# EAGLE design lcd_5_breakout (EAGLE 5.11)
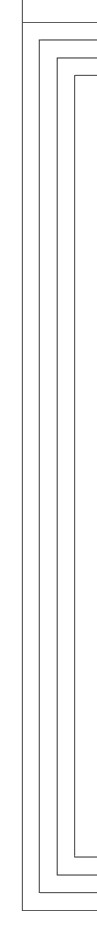
[diagram p0: schematic, sheet 1, part 1 of 2]
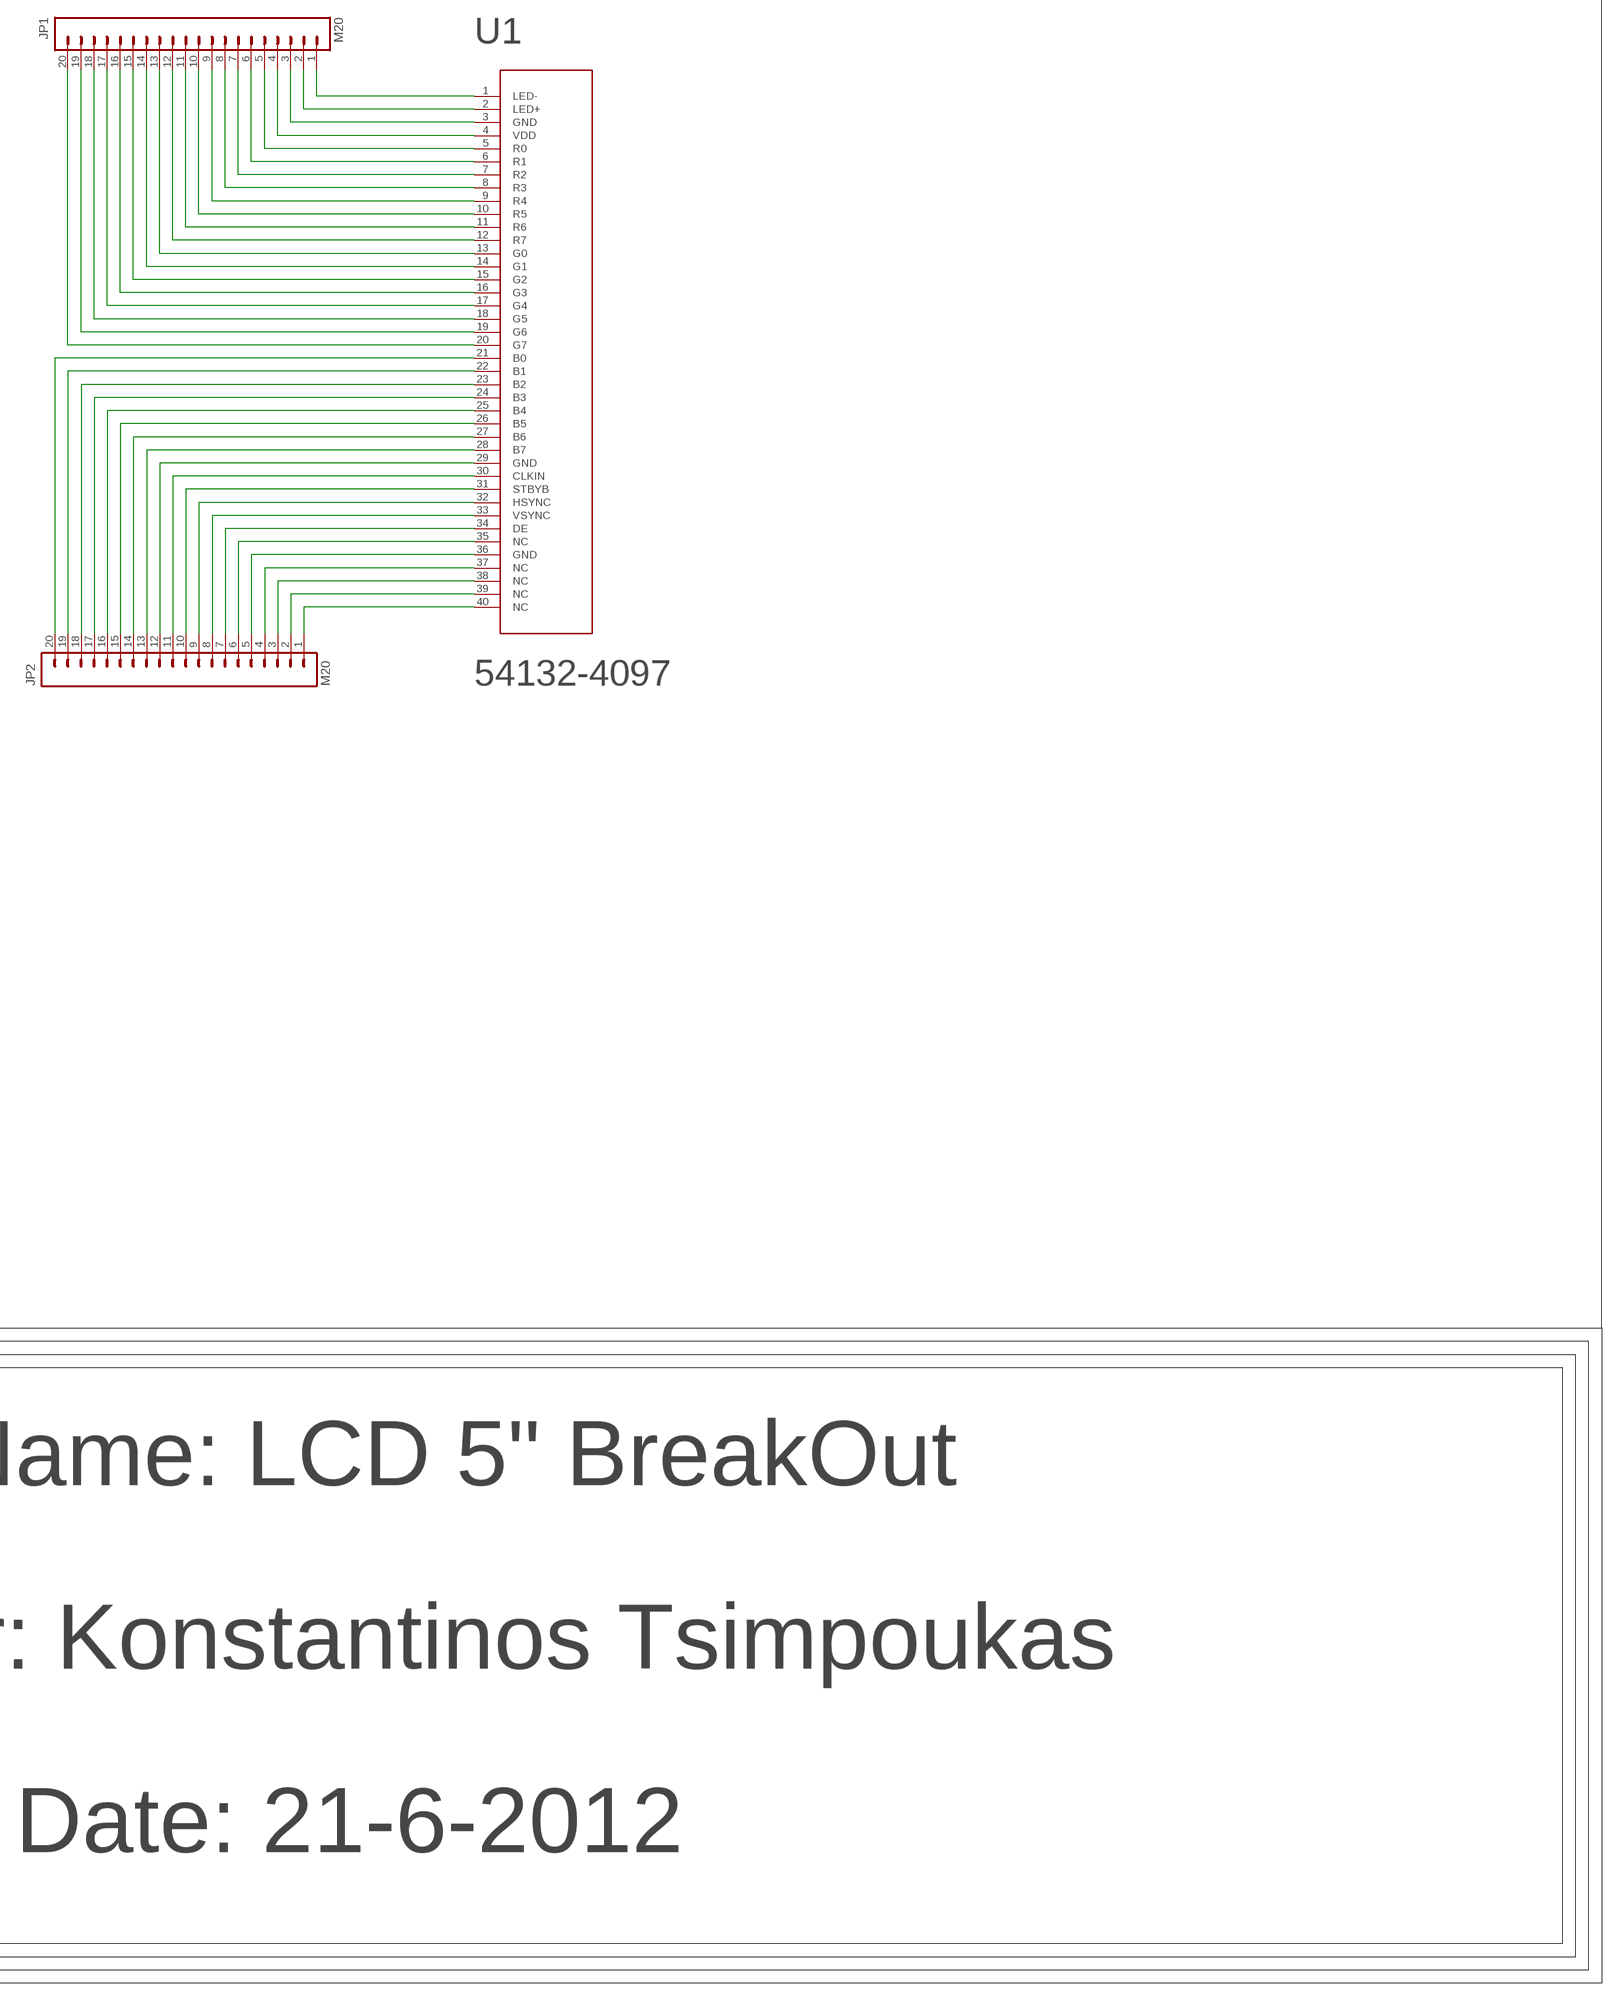
[diagram p1: schematic, sheet 1, part 2 of 2]

## Parts
JP1  M20  [1X20]
JP2  M20  [1X20]
U1  54132-4097  [MOLEX_40_FFC_FPC]

## Nets
B0: JP2.20 U1.21(B0)
B1: JP2.19 U1.22(B1)
B2: JP2.18 U1.23(B2)
B3: JP2.17 U1.24(B3)
B4: JP2.16 U1.25(B4)
B5: JP2.15 U1.26(B5)
B6: JP2.14 U1.27(B6)
B7: JP2.13 U1.28(B7)
CLKIN: JP2.11 U1.30(CLKIN)
DE: JP2.7 U1.34(DE)
G0: JP1.13 U1.13(G0)
G1: JP1.14 U1.14(G1)
G2: JP1.15 U1.15(G2)
G3: JP1.16 U1.16(G3)
G4: JP1.17 U1.17(G4)
G5: JP1.18 U1.18(G5)
G6: JP1.19 U1.19(G6)
G7: JP1.20 U1.20(G7)
GND0: JP1.3 U1.3(GND)
GND1: JP2.12 U1.29(GND)
GND2: JP2.5 U1.36(GND)
HSYNC: JP2.9 U1.32(HSYNC)
LED+: JP1.2 U1.2(LED+)
LED-: JP1.1 U1.1(LED-)
NC: JP2.6 U1.35(NC)
NC1: JP2.4 U1.37(NC)
NC2: JP2.3 U1.38(NC)
NC3: JP2.2 U1.39(NC)
NC4: JP2.1 U1.40(NC)
R0: JP1.5 U1.5(R0)
R1: JP1.6 U1.6(R1)
R2: JP1.7 U1.7(R2)
R3: JP1.8 U1.8(R3)
R4: JP1.9 U1.9(R4)
R5: JP1.10 U1.10(R5)
R6: JP1.11 U1.11(R6)
R7: JP1.12 U1.12(R7)
STBYB: JP2.10 U1.31(STBYB)
VDD: JP1.4 U1.4(VDD)
VSYNC: JP2.8 U1.33(VSYNC)

## Notes on the sheet
- Circuit Name: LCD 5" BreakOut
- Designer: Konstantinos Tsimpoukas
- Date: 21-6-2012

## Library data of the parts
JP1 JP2 = SparkFun:M20: This is just like the LOCK variant in that the holes are staggared by 5 mil, but except for the last two holes. They are not altered from the "standard" footprint layout. This is used for a special purpose on the layout of our Graphic LCD Backpack. Make sure you want to use this device before selecting it for you project!
U1 = beaglebone_components:54132-4097: MOLEX 40 PIN FPC

## Net classes
0 DATA: width 0.127 mm, drill 0.254 mm, clearance 0.127 mm
1 GND: width 0.203 mm, drill 0.254 mm, clearance 0.152 mm to class 0, clearance 0.152 mm
2 +5V: width 0.203 mm, drill 0.254 mm, clearance 0.152 mm to class 0, clearance 0.127 mm to class 1, clearance 0.127 mm
3 +3.3V: width 0.203 mm, drill 0.254 mm, clearance 0.127 mm to class 0, clearance 0.127 mm to class 1, clearance 0.127 mm to class 2, clearance 0.127 mm
4 +1.8V: width 0.203 mm, drill 0.254 mm, clearance 0.127 mm to class 0, clearance 0.127 mm to class 1, clearance 0.127 mm to class 2, clearance 0.127 mm to class 3, clearance 0.127 mm
5 +1.1V: width 0.203 mm, drill 0.254 mm, clearance 0.127 mm to class 0, clearance 0.127 mm to class 1, clearance 0.127 mm to class 2, clearance 0.127 mm to class 3, clearance 0.127 mm to class 4, clearance 0.127 mm
6 +1.3V: width 0.203 mm, drill 0.254 mm, clearance 0.127 mm to class 0, clearance 0.127 mm to class 1, clearance 0.127 mm to class 2, clearance 0.127 mm to class 3, clearance 0.127 mm to class 4, clearance 0.127 mm to class 5, clearance 0.127 mm

## Board
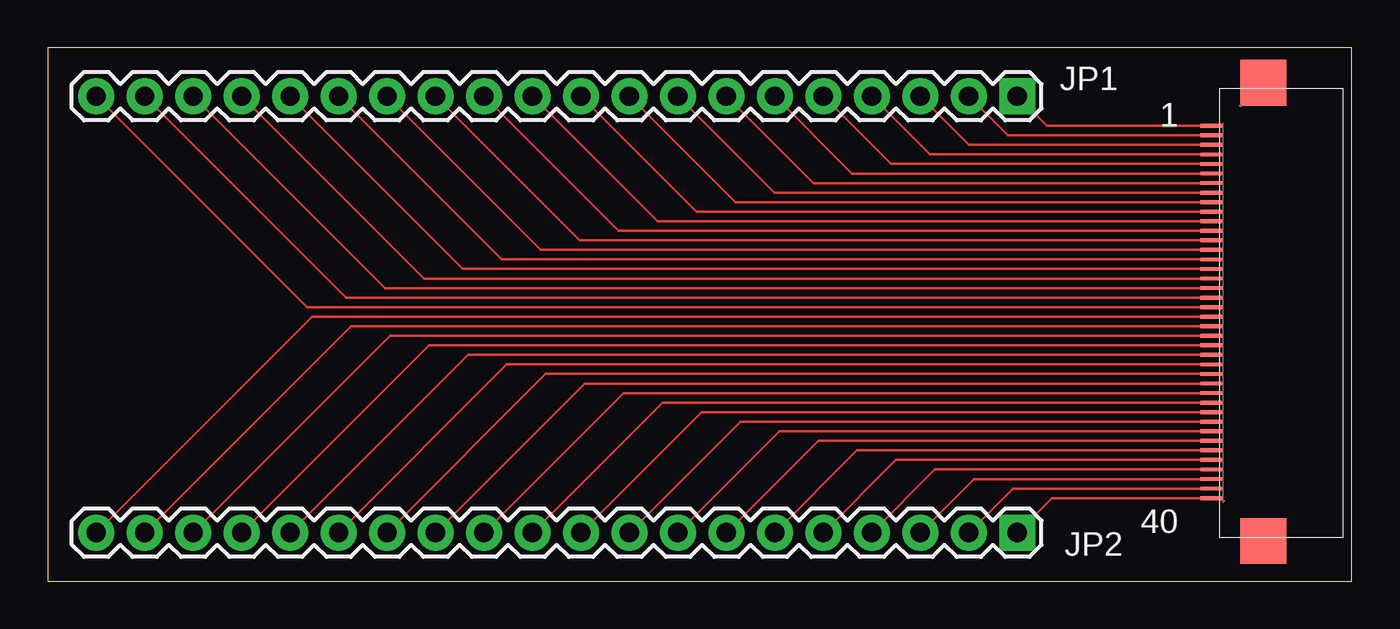
[diagram p2: board, top side]

Size 68.33 x 27.94 mm. Coordinates in mm from the lower left corner, seen from the top.
Outline: 0,0 68.33,0 68.33,27.94 0,27.94 0,0
Copper layers (1*16): Top 0.035mm / dielectric 1.5mm / Bottom 0.035mm
Design rules "default": minimum track width 10mil, minimum drill 24mil, track to track 8mil, track to pad 8mil, pad to pad 8mil, via to via 8mil, smd to smd 8mil, copper to edge 40mil, drill to drill 8mil, minimum pad ring 10mil, minimum via ring 8mil, stop-mask expansion 4mil, vias tented up to drill 0mil, thermal gap 10mil

### Footprints (pad centres in the part's own frame; a part is rotated, then mirrored left to right if it is on the bottom)
1X20 = drill 1.016 pad 1.88 square: 1 0,0 | drill 1.016 pad 1.88 round: 2 2.54,0; 3 5.08,0; 4 7.62,0; 5 10.16,0; 6 12.7,0; 7 15.24,0; 8 17.78,0; 9 20.32,0; 10 22.86,0; 11 25.4,0; 12 27.94,0; 13 30.48,0; 14 33.02,0; 15 35.56,0; 16 38.1,0; 17 40.64,0; 18 43.18,0; 19 45.72,0; 20 48.26,0
MOLEX_40_FFC_FPC = smd 1.2 x 0.2: 1 -4.04,9.12; 2 -4.04,8.62; 3 -4.04,8.12; 4 -4.04,7.62; 5 -4.04,7.12; 6 -4.04,6.62; 7 -4.04,6.12; 8 -4.04,5.62; 9 -4.04,5.12; 10 -4.04,4.62; 11 -4.04,4.12; 12 -4.04,3.62; 13 -4.04,3.12; 14 -4.04,2.62; 15 -4.04,2.12; 16 -4.04,1.62; 17 -4.04,1.12; 18 -4.04,0.62; 19 -4.04,0.12; 20 -4.04,-0.38; 21 -4.04,-0.88; 22 -4.04,-1.38; 23 -4.04,-1.88; 24 -4.04,-2.38; 25 -4.04,-2.88; 26 -4.04,-3.38; 27 -4.04,-3.88; 28 -4.04,-4.38; 29 -4.04,-4.88; 30 -4.04,-5.38; 31 -4.04,-5.88; 32 -4.04,-6.38; 33 -4.04,-6.88; 34 -4.04,-7.38; 35 -4.04,-7.88; 36 -4.04,-8.38; 37 -4.04,-8.88; 38 -4.04,-9.38; 39 -4.04,-9.88; 40 -4.04,-10.38 | smd 2.4 x 2.4: SOLDERED1 -1.34,-12.63; SOLDERED2 -1.34,11.37

### Placement (x,y rotation side)
JP1  50.8,25.4 180 top
JP2  50.8,2.54 180 top
U1  65.02,14.73 0 top

### Tracks (layer width: path | path; a pad name or v marks a point on that pad's centre or on a via)
B0
  Top 0.127: U1.21 13.85,13.85 JP2.20
B1
  Top 0.127: U1.22 15.89,13.35 JP2.19
B2
  Top 0.127: U1.23 17.93,12.85 JP2.18
B3
  Top 0.127: U1.24 19.97,12.35 JP2.17
B4
  Top 0.127: U1.25 22.01,11.85 JP2.16
B5
  Top 0.127: U1.26 24.05,11.35 JP2.15
B6
  Top 0.127: U1.27 26.09,10.85 JP2.14
B7
  Top 0.127: U1.28 28.13,10.35 JP2.13
CLKIN
  Top 0.127: U1.30 32.21,9.35 JP2.11
DE
  Top 0.127: U1.34 40.37,7.35 JP2.7
G0
  Top 0.127: U1.13 27.87,17.85 JP1.13
G1
  Top 0.127: U1.14 25.83,17.35 JP1.14
G2
  Top 0.127: U1.15 23.79,16.85 JP1.15
G3
  Top 0.127: U1.16 21.75,16.35 JP1.16
G4
  Top 0.127: U1.17 19.71,15.85 JP1.17
G5
  Top 0.127: U1.18 17.67,15.35 JP1.18
G6
  Top 0.127: U1.19 15.63,14.85 JP1.19
G7
  Top 0.127: U1.20 13.59,14.35 JP1.20
GND0
  Top 0.127: U1.3 48.27,22.85 JP1.3
GND1
  Top 0.127: U1.29 30.17,9.85 JP2.12
GND2
  Top 0.127: U1.36 44.45,6.35 JP2.5
HSYNC
  Top 0.127: U1.32 36.29,8.35 JP2.9
LED+
  Top 0.127: U1.2 50.31,23.35 JP1.2
LED-
  Top 0.127: U1.1 52.35,23.85 JP1.1
NC
  Top 0.127: U1.35 42.41,6.85 JP2.6
NC1
  Top 0.127: U1.37 46.49,5.85 JP2.4
NC2
  Top 0.127: U1.38 48.53,5.35 JP2.3
NC3
  Top 0.127: U1.39 50.57,4.85 JP2.2
NC4
  Top 0.127: U1.40 52.61,4.35 JP2.1
R0
  Top 0.127: U1.5 44.19,21.85 JP1.5
R1
  Top 0.127: U1.6 42.15,21.35 JP1.6
R2
  Top 0.127: U1.7 40.11,20.85 JP1.7
R3
  Top 0.127: U1.8 38.07,20.35 JP1.8
R4
  Top 0.127: U1.9 36.03,19.85 JP1.9
R5
  Top 0.127: U1.10 33.99,19.35 JP1.10
R6
  Top 0.127: U1.11 31.95,18.85 JP1.11
R7
  Top 0.127: U1.12 29.91,18.35 JP1.12
STBYB
  Top 0.127: U1.31 34.25,8.85 JP2.10
VDD
  Top 0.127: U1.4 46.23,22.35 JP1.4
VSYNC
  Top 0.127: U1.33 38.33,7.85 JP2.8